# Altium schematic sheet CAp_SRV.SchDoc
size A3; Author: Audran; CompanyName: Goldorak; Address1: Electrolab; Address2: 52 rue Paul Lescop; Address3: 92000 Nanterre; ProjectName: Cartes_2017
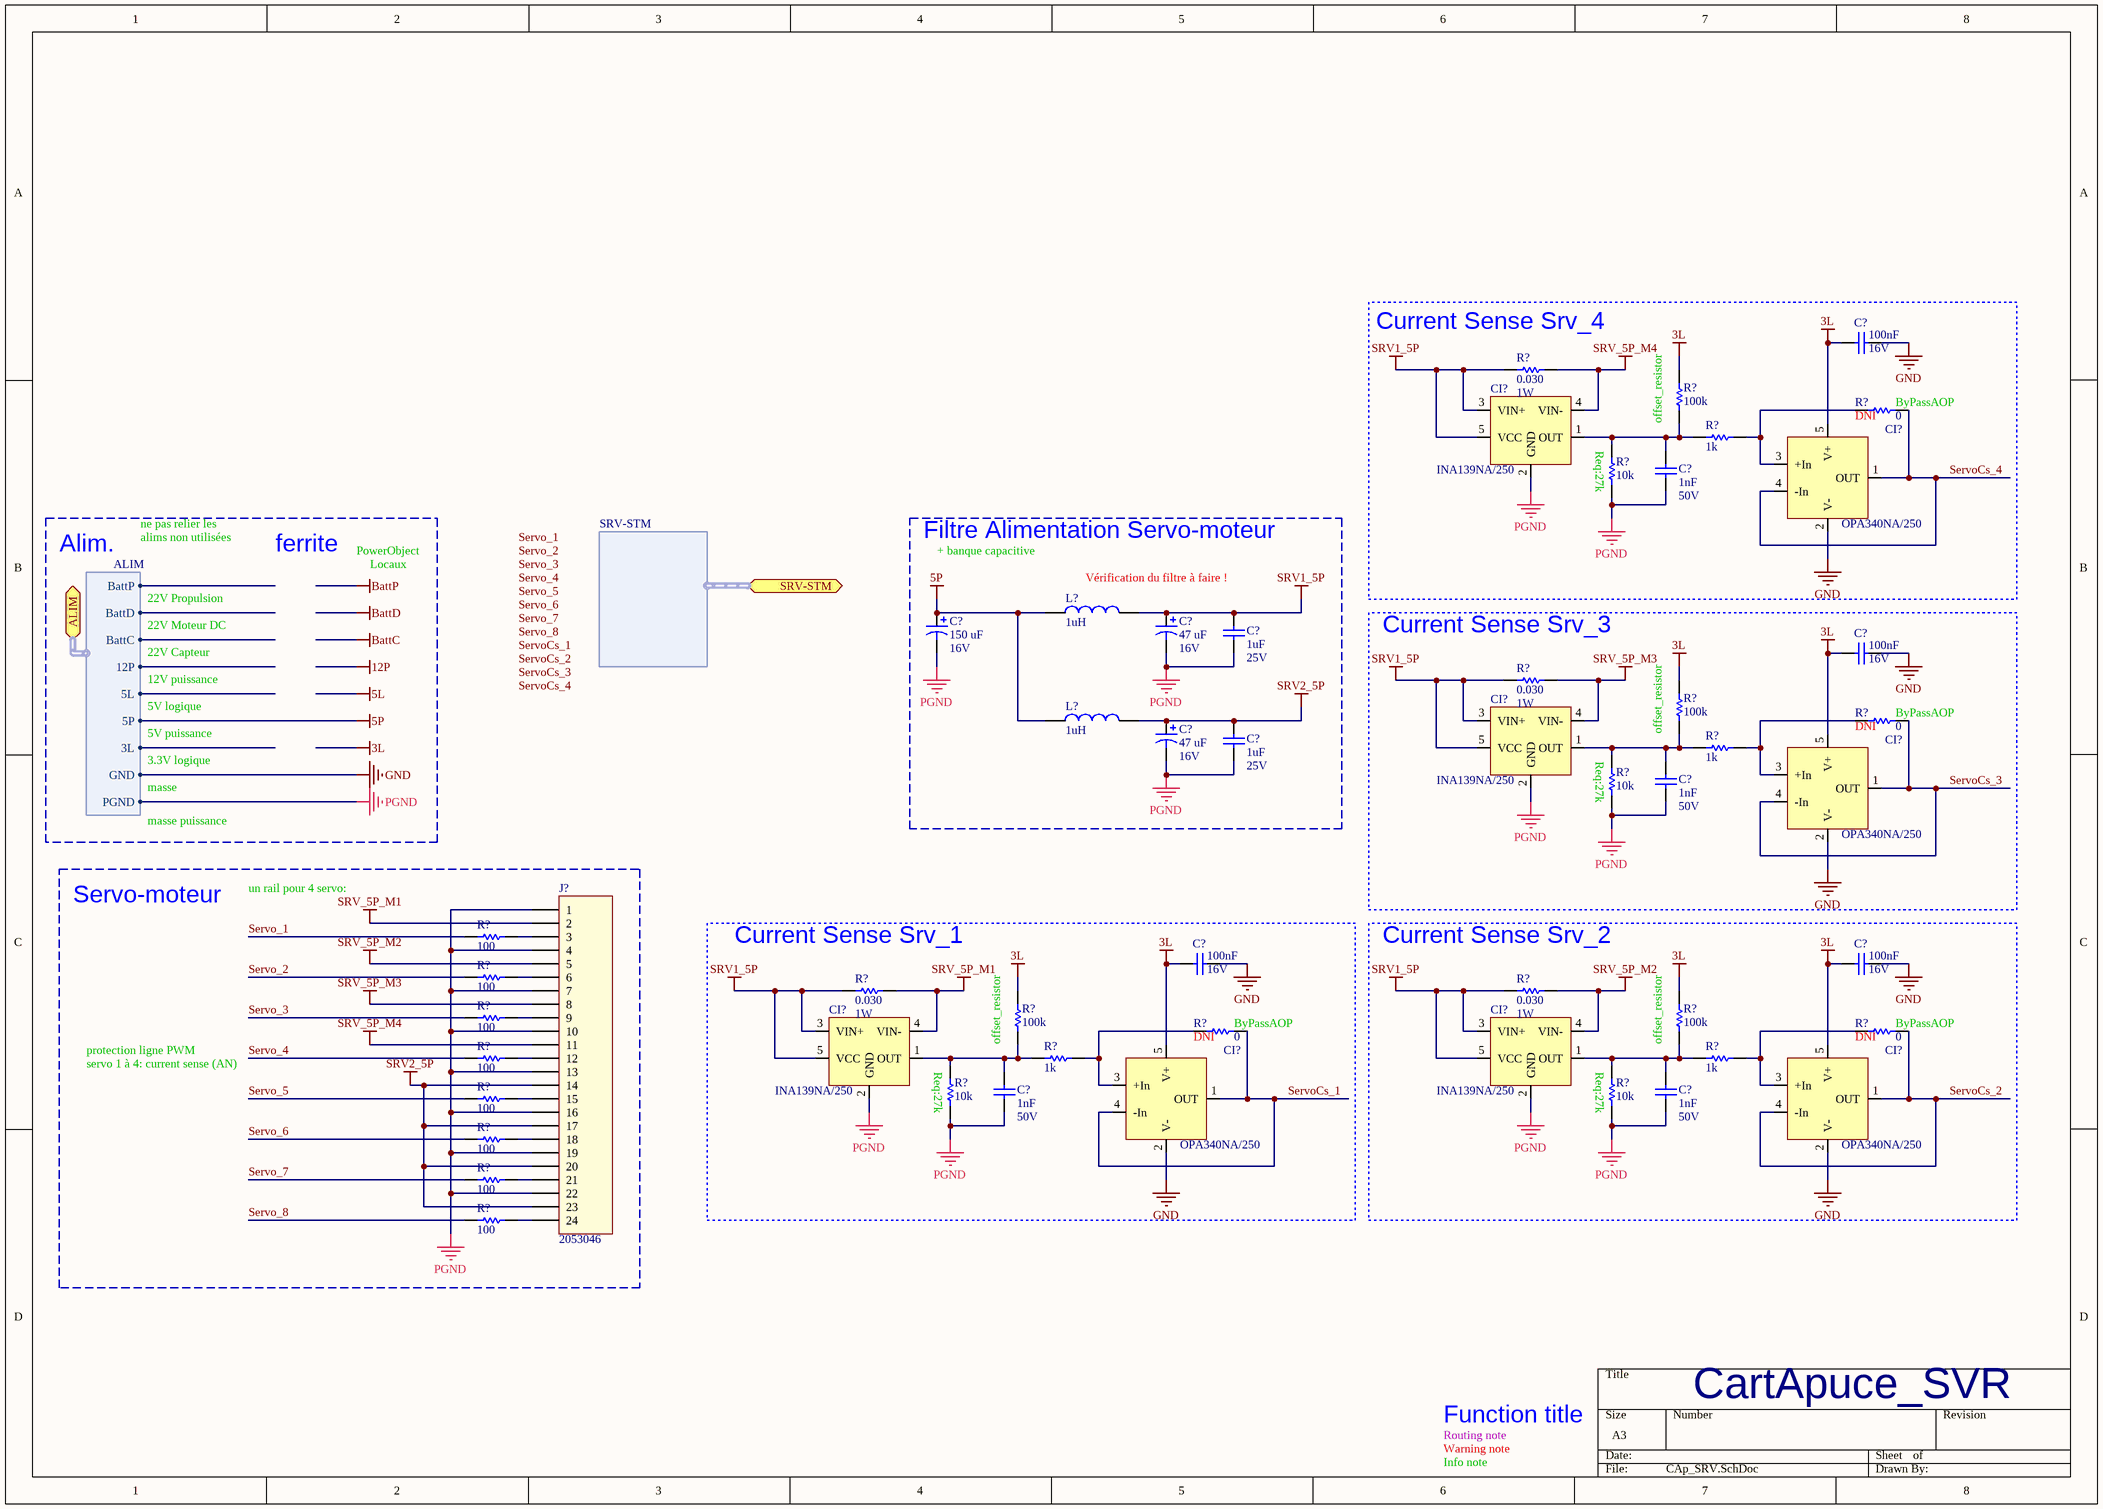
[diagram p0: CAp_SRV.SchDoc]

## Parts
(Parts that share a designator on the sheet are numbered #1, #2 ... from top to bottom, then left to right.)
C?#1  100nF  RatedVoltage: 16V  [WCAP-CSGP_0402, 1x0.5x0.5]
C?#2  1nF  RatedVoltage: 50V  [WCAP-CSGP_0402, 1x0.5x0.5]
C?#3  150 uF  RatedVoltage: 16V  [WCAP-ATG8_6.3x11x2.5x0.5]
C?#4  47 uF  RatedVoltage: 16V  [WCAP-ATG8_5x11x2x0.5]
C?#5  1uF  RatedVoltage: 25V  [WCAP-CSGP_0603, 1.6x0.8x0.8]
C?#6  100nF  RatedVoltage: 16V  [WCAP-CSGP_0402, 1x0.5x0.5]
C?#7  47 uF  RatedVoltage: 16V  [WCAP-ATG8_5x11x2x0.5]
C?#8  1uF  RatedVoltage: 25V  [WCAP-CSGP_0603, 1.6x0.8x0.8]
C?#9  1nF  RatedVoltage: 50V  [WCAP-CSGP_0402, 1x0.5x0.5]
C?#10  100nF  RatedVoltage: 16V  [WCAP-CSGP_0402, 1x0.5x0.5]
C?#11  100nF  RatedVoltage: 16V  [WCAP-CSGP_0402, 1x0.5x0.5]
C?#12  1nF  RatedVoltage: 50V  [WCAP-CSGP_0402, 1x0.5x0.5]
C?#13  1nF  RatedVoltage: 50V  [WCAP-CSGP_0402, 1x0.5x0.5]
CI?#1  INA139NA/250  [SOT95P245X145-5N]
CI?#2  OPA340NA/250  [SOT95P245X145-5N]
CI?#3  INA139NA/250  [SOT95P245X145-5N]
CI?#4  OPA340NA/250  [SOT95P245X145-5N]
CI?#5  INA139NA/250  [SOT95P245X145-5N]
CI?#6  INA139NA/250  [SOT95P245X145-5N]
CI?#7  OPA340NA/250  [SOT95P245X145-5N]
CI?#8  OPA340NA/250  [SOT95P245X145-5N]
J?  Supplier Part Number 1: 2053046  [TSW-108-08-F-T-RA]  (hidden comment: TSW-108-08-F-T-RA)
L?#1  value 1uH  [WE-PD2_4532]  (hidden comment: WE-PD2, 7447730)
L?#2  value 1uH  [WE-PD2_4532]  (hidden comment: WE-PD2, 7447730)
R?#1  value 0.030  Power: 1W  [WSLP1206]  (hidden comment: WSLP1206R0300FEA)
R?#2  value 0  [RESC1005X04N]  (hidden comment: RC0402JR-070RL)
R?#3  value 100k  [RESC1005X04N]  (hidden comment: RC0402FR-07100KL)
R?#4  value 1k  [RESC1005X04N]  (hidden comment: RC0402FR-071KL)
R?#5  value 10k  [RESC1005X04N]  (hidden comment: RC0402FR-0710KL)
R?#6  value 0.030  Power: 1W  [WSLP1206]  (hidden comment: WSLP1206R0300FEA)
R?#7  value 0  [RESC1005X04N]  (hidden comment: RC0402JR-070RL)
R?#8  value 100k  [RESC1005X04N]  (hidden comment: RC0402FR-07100KL)
R?#9  value 1k  [RESC1005X04N]  (hidden comment: RC0402FR-071KL)
R?#10  value 10k  [RESC1005X04N]  (hidden comment: RC0402FR-0710KL)
R?#11  value 100  [RESC1005X04N]  (hidden comment: RC0402FR-07100RL)
R?#12  value 100  [RESC1005X04N]  (hidden comment: RC0402FR-07100RL)
R?#13  value 0.030  Power: 1W  [WSLP1206]  (hidden comment: WSLP1206R0300FEA)
R?#14  value 0.030  Power: 1W  [WSLP1206]  (hidden comment: WSLP1206R0300FEA)
R?#15  value 100  [RESC1005X04N]  (hidden comment: RC0402FR-07100RL)
R?#16  value 0  [RESC1005X04N]  (hidden comment: RC0402JR-070RL)
R?#17  value 0  [RESC1005X04N]  (hidden comment: RC0402JR-070RL)
R?#18  value 100k  [RESC1005X04N]  (hidden comment: RC0402FR-07100KL)
R?#19  value 100k  [RESC1005X04N]  (hidden comment: RC0402FR-07100KL)
R?#20  value 100  [RESC1005X04N]  (hidden comment: RC0402FR-07100RL)
R?#21  value 1k  [RESC1005X04N]  (hidden comment: RC0402FR-071KL)
R?#22  value 1k  [RESC1005X04N]  (hidden comment: RC0402FR-071KL)
R?#23  value 100  [RESC1005X04N]  (hidden comment: RC0402FR-07100RL)
R?#24  value 10k  [RESC1005X04N]  (hidden comment: RC0402FR-0710KL)
R?#25  value 10k  [RESC1005X04N]  (hidden comment: RC0402FR-0710KL)
R?#26  value 100  [RESC1005X04N]  (hidden comment: RC0402FR-07100RL)
R?#27  value 100  [RESC1005X04N]  (hidden comment: RC0402FR-07100RL)
R?#28  value 100  [RESC1005X04N]  (hidden comment: RC0402FR-07100RL)

## Blocks framed on the sheet
Current Sense Srv_4: C?#1 C?#2 CI?#1 CI?#2 R?#1-R?#5
Filtre Alimentation Servo-moteur: C?#3-C?#5 C?#7 C?#8 L?#1 L?#2
Current Sense Srv_3: C?#6 C?#9 CI?#3 CI?#4 R?#6-R?#10
Servo-moteur: J? R?#11 R?#12 R?#15 R?#20 R?#23 R?#26-R?#28
Current Sense Srv_1: C?#10 C?#12 CI?#5 CI?#7 R?#13 R?#16 R?#18 R?#21 R?#24
Current Sense Srv_2: C?#11 C?#13 CI?#6 CI?#8 R?#14 R?#17 R?#19 R?#22 R?#25

## Ports
ALIM (harness ALIM), SRV-STM (harness SRV-STM)

## Harnesses
SRV-STM: 
ALIM: BattP, BattD, BattC, 12P, 5L, 5P, 3L, GND, PGND

## Nets
3L: C?#1.1 C?#6.1 C?#10.1 C?#11.1 CI?#2.5(V+) CI?#4.5(V+) CI?#7.5(V+) CI?#8.5(V+) R?#3.2 R?#8.2 R?#18.2 R?#19.2
5P: C?#3.1 L?#1.1 L?#2.1 ; port ALIM.5P
GND: C?#1.2 C?#6.2 C?#10.2 C?#11.2 CI?#2.2(V-) CI?#4.2(V-) CI?#7.2(V-) CI?#8.2(V-) ; port ALIM.GND
PGND: C?#2.1 C?#3.2 C?#4.2 C?#5.1 C?#7.2 C?#8.1 C?#9.1 C?#12.1 C?#13.1 CI?#1.2(GND) CI?#3.2(GND) CI?#5.2(GND) CI?#6.2(GND) J?.1 J?.4 J?.7 J?.10 J?.13 J?.16 J?.19 J?.22 R?#5.1 R?#10.1 R?#24.1 R?#25.1 ; port ALIM.PGND
SRV1_5P: C?#4.1 C?#5.2 CI?#1.3(VIN+) CI?#1.5(VCC) CI?#3.3(VIN+) CI?#3.5(VCC) CI?#5.3(VIN+) CI?#5.5(VCC) CI?#6.3(VIN+) CI?#6.5(VCC) L?#1.2 R?#1.1 R?#6.1 R?#13.1 R?#14.1
SRV2_5P: C?#7.1 C?#8.2 J?.14 J?.17 J?.20 J?.23 L?#2.2
SRV_5P_M1: CI?#5.4(VIN-) J?.2 R?#13.2
SRV_5P_M2: CI?#6.4(VIN-) J?.5 R?#14.2
SRV_5P_M3: CI?#3.4(VIN-) J?.8 R?#6.2
SRV_5P_M4: CI?#1.4(VIN-) J?.11 R?#1.2
Servo_1: R?#11.1
Servo_2: R?#12.1
Servo_3: R?#15.1
Servo_4: R?#20.1
Servo_5: R?#23.1
Servo_6: R?#26.1
Servo_7: R?#27.1
Servo_8: R?#28.1
ServoCs_1: CI?#7.1(OUT) CI?#7.4(-In) R?#16.2
ServoCs_2: CI?#8.1(OUT) CI?#8.4(-In) R?#17.2
ServoCs_3: CI?#4.1(OUT) CI?#4.4(-In) R?#7.2
ServoCs_4: CI?#2.1(OUT) CI?#2.4(-In) R?#2.2
NetC?#2_2: C?#2.2 CI?#1.1(OUT) R?#3.1 R?#4.1 R?#5.2
NetC?#9_2: C?#9.2 CI?#3.1(OUT) R?#8.1 R?#9.1 R?#10.2
NetC?#12_2: C?#12.2 CI?#5.1(OUT) R?#18.1 R?#21.1 R?#24.2
NetC?#13_2: C?#13.2 CI?#6.1(OUT) R?#19.1 R?#22.1 R?#25.2
NetCI?#2_3: CI?#2.3(+In) R?#2.1 R?#4.2
NetCI?#4_3: CI?#4.3(+In) R?#7.1 R?#9.2
NetCI?#7_3: CI?#7.3(+In) R?#16.1 R?#21.2
NetCI?#8_3: CI?#8.3(+In) R?#17.1 R?#22.2
NetJ?_3: J?.3 R?#11.2
NetJ?_6: J?.6 R?#12.2
NetJ?_9: J?.9 R?#15.2
NetJ?_12: J?.12 R?#20.2
NetJ?_15: J?.15 R?#23.2
NetJ?_18: J?.18 R?#26.2
NetJ?_21: J?.21 R?#27.2
NetJ?_24: J?.24 R?#28.2

## Notes on the sheet
- (near R?#5) Req:27k
- (near R?#3) offset_resistor
- (near R?#2) DNI
- (near R?#2) ByPassAOP
- Alim.
- ne pas relier les
- alims non utilisées
- ferrite
- PowerObject
- Locaux
- + banque capacitive
- Vérification du filtre à faire !
- 22V Propulsion
- 22V Moteur DC
- 5V logique
- 12V puissance
- 22V Capteur
- (near R?#7) ByPassAOP
- 5V puissance
- 3.3V logique
- (near R?#10) Req:27k
- (near R?#8) offset_resistor
- (near R?#7) DNI
- masse
- masse puissance
- un rail pour 4 servo:
- protection ligne PWM
- (near R?#18) offset_resistor
- (near R?#16) DNI
- (near R?#16) ByPassAOP
- (near R?#19) offset_resistor
- (near R?#17) DNI
- (near R?#17) ByPassAOP
- servo 1 à 4: current sense (AN)
- (near R?#24) Req:27k
- (near R?#25) Req:27k
- Routing note
- Warning note
- Function title
- CartApuce_SVR
- Info note
- Labels drawn without touching a wire or pin: Servo_1, Servo_2, Servo_3, Servo_4, Servo_5, Servo_6, Servo_7, Servo_8, ServoCs_1, ServoCs_2, ServoCs_3, ServoCs_4

## Library data of the parts
C?#1 C?#6 C?#10 C?#11 = WCAP-CSGP, 885012205037: CAP CER 100nF 16V X7R 0402; Manufacturer: Wurth Elektronik; PublishedDate: Aug 2016; ComponentLink1Description: Manufacturer; ComponentLink1URL: http://www.we-online.de; ComponentLink2Description: Datasheet; ComponentLink2URL: http://katalog.we-online.com/pbs/datasheet/885012205037.pdf; Value: 100nF; Size: 0402; CeramicType: X7R; Manufacturer Part Number: 885012205037
C?#2 C?#9 C?#12 C?#13 = WCAP-CSGP, 885012205061: CAP CER 1nF 50V X7R 0402; Manufacturer: Wurth Elektronik; PublishedDate: Aug 2016; ComponentLink1Description: Manufacturer; ComponentLink1URL: http://www.we-online.de; ComponentLink2Description: Datasheet; ComponentLink2URL: http://katalog.we-online.com/pbs/datasheet/885012205061.pdf; Manufacturer Part Number: 885012205061; Value: 1nF; Size: 0402; CeramicType: X7R
C?#3 = WCAP-ATG8, 860010373008: CAP Alu 150 UF 20% 16 V; Manufacturer: Wurth Elektronik; PublishedDate: July 2016; ComponentLink1Description: Manufacturer; ComponentLink1URL: http://www.we-online.de; ComponentLink2Description: Datasheet; ComponentLink2URL: http://katalog.we-online.de/pbs/datasheet/860010373008.pdf; Manufacturer Part Number: 860010373008; Value: 150 uF; Size: 6.3mmx11mm
C?#4 C?#7 = WCAP-ATG8, 860010372004: CAP Alu 47 UF 20% 16 V; Manufacturer: Wurth Elektronik; PublishedDate: July 2016; ComponentLink1Description: Manufacturer; ComponentLink1URL: http://www.we-online.de; ComponentLink2Description: Datasheet; ComponentLink2URL: http://katalog.we-online.de/pbs/datasheet/860010372004.pdf; Manufacturer Part Number: 860010372004; Value: 47 uF; Size: 5mmx11mm
C?#5 C?#8 = WCAP-CSGP, 885012206076: CAP CER 1uF 25V X7R 0603; Manufacturer: Wurth Elektronik; PublishedDate: Aug 2016; ComponentLink1Description: Manufacturer; ComponentLink1URL: http://www.we-online.de; ComponentLink2Description: Datasheet; ComponentLink2URL: http://katalog.we-online.com/pbs/datasheet/885012206076.pdf; Manufacturer Part Number: 885012206076; Value: 1uF; Size: 0603; CeramicType: X7R
CI?#1 CI?#3 CI?#5 CI?#6 = INA139NA/250: IC CURRENT MONITOR 0.5% SOT23-5; Manufacturer: Texas Instruments; Supplier 1: Farnell; Supplier Part Number 1: 1470398; Manufacturer Part Number: INA139NA/250; ComponentLink1URL: http://www.ti.com/lit/ds/symlink/ina139.pdf; ComponentLink1Description: http://www.ti.com/lit/ds/symlink/ina139.pdf
CI?#2 CI?#4 CI?#7 CI?#8 = OPA340NA/250: IC OP AMP GP 5.5MHZ RRIO SOT23-5; Manufacturer: Texas Instruments; Supplier 1: Farnell; Supplier Part Number 1: 1470372; ComponentLink1URL: http://www.ti.com/lit/ds/symlink/opa2340.pdf; ComponentLink1Description: http://www.ti.com/lit/ds/symlink/opa2340.pdf; Manufacturer Part Number: OPA340NA/250
J? = TSW-108-08-F-T-RA: samtec 3x8 : TSW-108-08-F-T-RA; Manufacturer Part Number: TSW-104-08-F-T-RA; Manufacturer 1: SAMTEC; ComponentLink2URL: http://cloud.samtec.com/catalog_english/TSW_TH.PDF; ComponentLink2Description: http://cloud.samtec.com/catalog_english/TSW_TH.PDF; Supplier 1: Farnell
L?#1 L?#2 = WE-PD2, 7447730: FIXED IND 1UH 4A 49 MOHM SMD; PublishedDate: Sep. 2016; Publisher: Wurth Elektronik; ComponentLink1Description: Manufacturer; ComponentLink1URL: http://www.we-online.de; ComponentLink2Description: Datasheet; ComponentLink2URL: http://katalog.we-online.de/pbs/datasheet/7447730.pdf; PartNumber: 7447730; Size: 4532
R?#1 R?#6 R?#13 R?#14 = WSLP1206R0300FEA: RES 0.03 OHM 1% 1W 1206; Manufacturer: Vishay Dale; Vmax: 200V; Type: Metal Strip; Precision: ±1%; ComponentLink1Description: http://www.vishay.com/docs/30122/wslp.pdf; Manufacturer Part Number: WSLP1206R0300FEA; ComponentLink1URL: http://www.vishay.com/docs/30122/wslp.pdf; Tolerance: ±1%; Power (Watts): 1W; Supplier Device Package: 1206; Supplier 1: Farnell; Supplier Part Number 1: 1886671
R?#2 R?#7 R?#16 R?#17 = RC0402JR-070RL: RES SMD 0 OHM 5% 1/16W 0402; Manufacturer: Yageo; Power: 63mW; Vmax: 50V; Type: Thick Film; ComponentLink1Description: Manufacturer; ComponentLink1URL: http://www.yageo.com/NewPortal/_en/index.jsp; ComponentLink2Description: Datasheet; ComponentLink2URL: http://www.farnell.com/datasheets/1018594.pdf; Manufacturer Part Number: RC0402JR-070RL; Supplier 1: Farnell; Supplier Part Number 1: 9232516; Precision: ±5%
R?#3 R?#8 R?#18 R?#19 = RC0402FR-07100KL: RES SMD 100K OHM 1% 1/16W 0402; Manufacturer: Yageo; Power: 63mW; Vmax: 50V; Type: Thick Film; ComponentLink1Description: Manufacturer; ComponentLink1URL: http://www.yageo.com/NewPortal/_en/index.jsp; ComponentLink2Description: Datasheet; ComponentLink2URL: http://www.farnell.com/datasheets/2167052.pdf; Manufacturer Part Number: RC0402FR-07100KL; Supplier 1: Farnell; Supplier Part Number 1: 9239472; Precision: ±1%
R?#4 R?#9 R?#21 R?#22 = RC0402FR-071KL: RES SMD 1K OHM 1% 1/16W 0402; Manufacturer: Yageo; Power: 63mW; Vmax: 50V; Type: Thick Film; ComponentLink1Description: Manufacturer; ComponentLink1URL: http://www.yageo.com/NewPortal/_en/index.jsp; ComponentLink2Description: Datasheet; ComponentLink2URL: http://www.farnell.com/datasheets/2167052.pdf; Manufacturer Part Number: RC0402FR-071KL; Supplier 1: Farnell; Supplier Part Number 1: 9239235; Precision: ±1%
R?#5 R?#10 R?#24 R?#25 = RC0402FR-0710KL: RES SMD 10K OHM 1% 1/16W 0402; Manufacturer: Yageo; Power: 63mW; Vmax: 50V; Type: Thick Film; ComponentLink1Description: Manufacturer; ComponentLink1URL: http://www.yageo.com/NewPortal/_en/index.jsp; ComponentLink2Description: Datasheet; ComponentLink2URL: http://www.farnell.com/datasheets/2167052.pdf; Supplier 1: Farnell; Supplier Part Number 1: 9239359; Manufacturer Part Number: RC0402FR-0710KL; Precision: ±1%
R?#11 R?#12 R?#15 R?#20 R?#23 R?#26-R?#28 = RC0402FR-07100RL: RES SMD 100 OHM 1% 1/16W 0402; Manufacturer: Yageo; Power: 63mW; Vmax: 50V; Type: Thick Film; ComponentLink1Description: Manufacturer; ComponentLink1URL: http://www.yageo.com/NewPortal/_en/index.jsp; ComponentLink2Description: Datasheet; ComponentLink2URL: http://www.farnell.com/datasheets/2167052.pdf; Manufacturer Part Number: RC0402FR-07100RL; Supplier 1: Farnell; Supplier Part Number 1: 9239111; Precision: ±1%